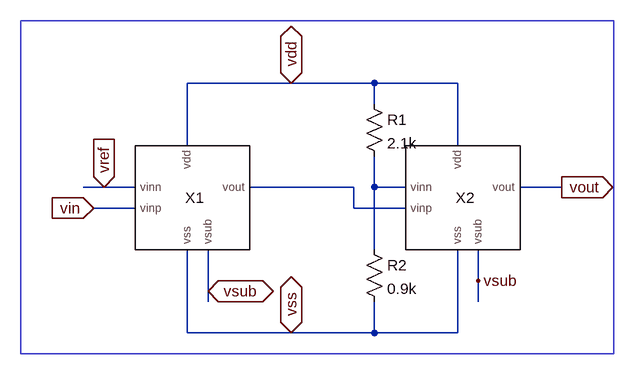
[diagram p0: schematic dsproj_twostagecomparator.asc]
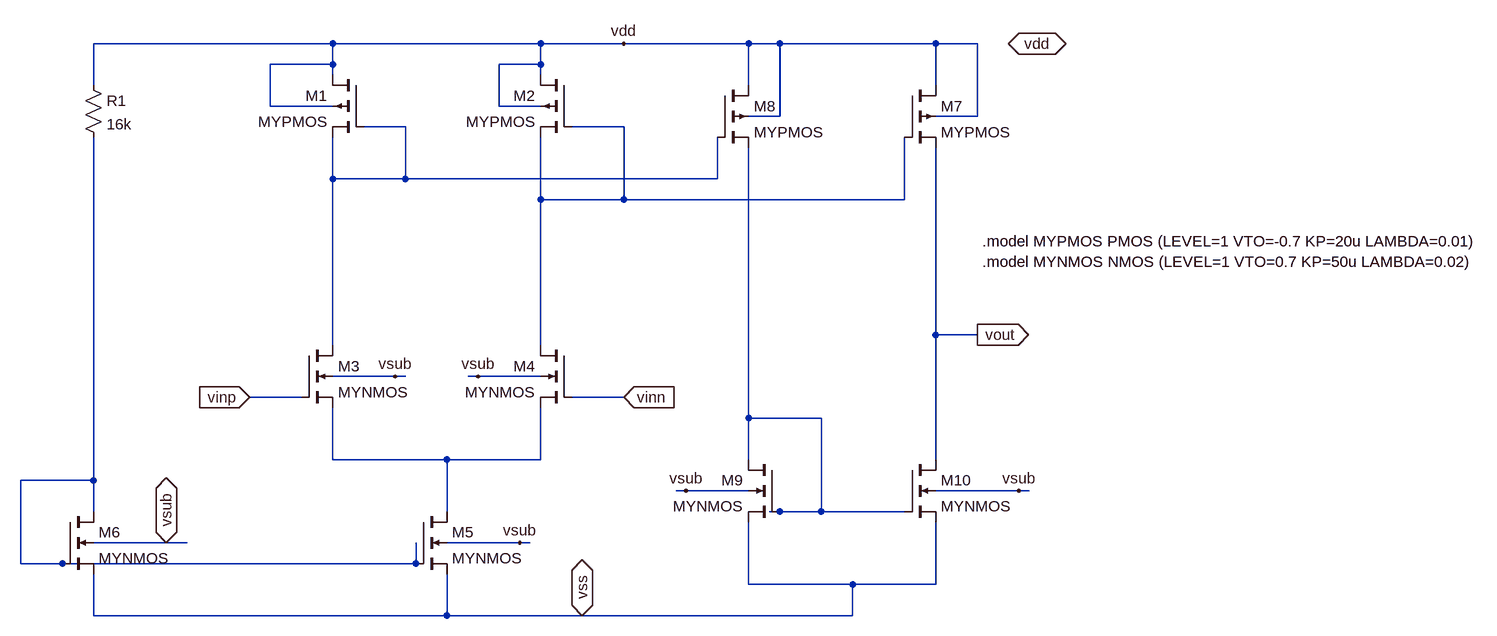
[diagram p1: sub-circuit dsproj_nmos_comparator.asc]
dsproj_twostagecomparator.asc, the LTspice schematic file:
Version 4
SHEET 1 880 680
WIRE 160 -32 0 -32
WIRE 288 -32 160 -32
WIRE 416 -32 288 -32
WIRE 288 0 288 -32
WIRE 0 64 0 -32
WIRE 416 64 416 -32
WIRE -128 128 -160 128
WIRE -80 128 -128 128
WIRE 256 128 96 128
WIRE 288 128 288 80
WIRE 336 128 288 128
WIRE 576 128 512 128
WIRE -80 160 -144 160
WIRE 256 160 256 128
WIRE 336 160 256 160
WIRE 288 224 288 128
WIRE 448 272 448 224
WIRE 32 288 32 224
WIRE 32 304 32 288
WIRE 448 304 448 272
WIRE 0 352 0 224
WIRE 160 352 0 352
WIRE 288 352 288 304
WIRE 288 352 160 352
WIRE 416 352 416 224
WIRE 416 352 288 352
FLAG 32 288 vsub
IOPIN 32 288 BiDir
FLAG 448 272 vsub
FLAG 160 -32 vdd
IOPIN 160 -32 BiDir
FLAG 160 352 vss
IOPIN 160 352 BiDir
FLAG -128 128 vref
IOPIN -128 128 In
FLAG -144 160 vin
IOPIN -144 160 In
FLAG 576 128 vout
IOPIN 576 128 Out
SYMBOL dsproj_nmos_comparator 0 144 R0
SYMATTR InstName X1
SYMBOL dsproj_nmos_comparator 416 144 R0
SYMATTR InstName X2
SYMBOL res 272 -16 R0
SYMATTR InstName R1
SYMATTR Value 2.1k
SYMBOL res 272 208 R0
SYMATTR InstName R2
SYMATTR Value 0.9k
RECTANGLE Normal 656 384 -256 -128

dsproj_nmos_comparator.asc, the sub-circuit schematic file:
Version 4.1
SHEET 1 1360 680
WIRE -432 -416 -800 -416
WIRE -112 -416 -432 -416
WIRE 16 -416 -112 -416
WIRE 208 -416 16 -416
WIRE 256 -416 208 -416
WIRE 496 -416 256 -416
WIRE 560 -416 496 -416
WIRE -432 -384 -432 -416
WIRE -432 -384 -528 -384
WIRE -112 -384 -112 -416
WIRE -112 -384 -176 -384
WIRE -432 -368 -432 -384
WIRE -112 -368 -112 -384
WIRE -800 -352 -800 -416
WIRE 208 -352 208 -416
WIRE 496 -352 496 -416
WIRE -528 -320 -528 -384
WIRE -432 -320 -528 -320
WIRE -176 -320 -176 -384
WIRE -112 -320 -176 -320
WIRE 256 -304 256 -416
WIRE 256 -304 208 -304
WIRE 560 -304 560 -416
WIRE 560 -304 496 -304
WIRE -320 -288 -384 -288
WIRE 16 -288 -64 -288
WIRE -432 -208 -432 -272
WIRE -320 -208 -320 -288
WIRE -320 -208 -432 -208
WIRE 160 -208 160 -272
WIRE 160 -208 -320 -208
WIRE -112 -176 -112 -272
WIRE 16 -176 16 -288
WIRE 16 -176 -112 -176
WIRE 448 -176 448 -272
WIRE 448 -176 16 -176
WIRE 496 32 496 -256
WIRE 560 32 496 32
WIRE -432 48 -432 -208
WIRE -112 48 -112 -176
WIRE -336 96 -432 96
WIRE -320 96 -336 96
WIRE -208 96 -224 96
WIRE -112 96 -208 96
WIRE -480 128 -560 128
WIRE 16 128 -64 128
WIRE 208 160 208 -256
WIRE 320 160 208 160
WIRE -432 224 -432 144
WIRE -256 224 -432 224
WIRE -112 224 -112 144
WIRE -112 224 -256 224
WIRE 208 224 208 160
WIRE 496 224 496 32
WIRE -800 256 -800 -272
WIRE -800 256 -912 256
WIRE 112 272 96 272
WIRE 208 272 112 272
WIRE 624 272 496 272
WIRE 640 272 624 272
WIRE -800 304 -800 256
WIRE -256 304 -256 224
WIRE 256 304 240 304
WIRE 320 304 320 160
WIRE 320 304 256 304
WIRE 448 304 320 304
WIRE -688 352 -800 352
WIRE -656 352 -688 352
WIRE -144 352 -256 352
WIRE -128 352 -144 352
WIRE -912 384 -912 256
WIRE -848 384 -912 384
WIRE -304 384 -304 352
WIRE -304 384 -848 384
WIRE 208 416 208 320
WIRE 368 416 208 416
WIRE 496 416 496 320
WIRE 496 416 368 416
WIRE -800 464 -800 400
WIRE -256 464 -256 400
WIRE -256 464 -800 464
WIRE -48 464 -256 464
WIRE 368 464 368 416
WIRE 368 464 -48 464
FLAG -208 96 vsub
FLAG 560 32 vout
IOPIN 560 32 Out
FLAG 608 -416 vdd
IOPIN 608 -416 BiDir
FLAG -560 128 vinp
IOPIN -560 128 In
FLAG 16 128 vinn
IOPIN 16 128 In
FLAG 112 272 vsub
FLAG 624 272 vsub
FLAG -48 464 vss
IOPIN -48 464 BiDir
FLAG -688 352 vsub
IOPIN -688 352 BiDir
FLAG -144 352 vsub
FLAG 16 -416 vdd
FLAG -336 96 vsub
SYMBOL pmos4 -384 -368 M0
SYMATTR InstName M1
SYMATTR Value MYPMOS
SYMATTR Value2 l=180e-9 w=1.2e-6 m=2
SYMBOL pmos4 -64 -368 M0
SYMATTR InstName M2
SYMATTR Value MYPMOS
SYMATTR Value2 l=180e-9 w=1.2e-6 m=2
SYMBOL nmos4 -64 48 M0
SYMATTR InstName M4
SYMATTR Value MYNMOS
SYMATTR Value2 l=180e-9 w=1.2e-6 m=3
SYMBOL nmos4 -304 304 R0
SYMATTR InstName M5
SYMATTR Value MYNMOS
SYMATTR Value2 l=3e-6 w=10e-6 m=2
SYMBOL res -816 -368 R0
SYMATTR InstName R1
SYMATTR Value 16k
SYMBOL nmos4 -848 304 R0
SYMATTR InstName M6
SYMATTR Value MYNMOS
SYMATTR Value2 l=3e-6 w=10e-6 m=2
SYMBOL nmos4 -480 48 R0
SYMATTR InstName M3
SYMATTR Value MYNMOS
SYMATTR Value2 l=180e-9 w=1.2e-6 m=3
SYMBOL pmos4 448 -352 R0
SYMATTR InstName M7
SYMATTR Value MYPMOS
SYMATTR Value2 l=180e-9 w=1.2e-6 m=2
SYMBOL pmos4 160 -352 R0
SYMATTR InstName M8
SYMATTR Value MYPMOS
SYMATTR Value2 l=180e-9 w=1.2e-6 m=2
SYMBOL nmos4 256 224 M0
SYMATTR InstName M9
SYMATTR Value MYNMOS
SYMATTR Value2 l=180e-9 w=1.2e-6 m=1
SYMBOL nmos4 448 224 R0
SYMATTR InstName M10
SYMATTR Value MYNMOS
SYMATTR Value2 l=180e-9 w=1.2e-6 m=1
TEXT 568 -112 Left 2 !.model MYPMOS PMOS (LEVEL=1 VTO=-0.7 KP=20u LAMBDA=0.01)\n.model MYNMOS NMOS (LEVEL=1 VTO=0.7 KP=50u LAMBDA=0.02)

The netlist it stands for:
* dsproj_twostagecomparator.asc
XX1 vref vin vdd N001 vss vsub dsproj_nmos_comparator
XX2 N002 N001 vdd vout vss vsub dsproj_nmos_comparator
R1 vdd N002 2.1k
R2 N002 vss 0.9k

* block symbol definitions
.subckt dsproj_nmos_comparator vinn vinp vdd vout vss vsub
M1 vdd N001 N001 vdd MYPMOS l=180e-9 w=1.2e-6 m=2
M2 vdd N002 N002 vdd MYPMOS l=180e-9 w=1.2e-6 m=2
M4 N002 vinn N004 vsub MYNMOS l=180e-9 w=1.2e-6 m=3
M5 N004 N005 vss vsub MYNMOS l=3e-6 w=10e-6 m=2
R1 vdd N005 16k
M6 N005 N005 vss vsub MYNMOS l=3e-6 w=10e-6 m=2
M3 N001 vinp N004 vsub MYNMOS l=180e-9 w=1.2e-6 m=3
M7 vdd N002 vout vdd MYPMOS l=180e-9 w=1.2e-6 m=2
M8 vdd N001 N003 vdd MYPMOS l=180e-9 w=1.2e-6 m=2
M9 N003 N003 vss vsub MYNMOS l=180e-9 w=1.2e-6 m=1
M10 vout N003 vss vsub MYNMOS l=180e-9 w=1.2e-6 m=1
.model MYPMOS PMOS (LEVEL=1 VTO=-0.7 KP=20u LAMBDA=0.01)
.model MYNMOS NMOS (LEVEL=1 VTO=0.7 KP=50u LAMBDA=0.02)
.ends dsproj_nmos_comparator

.model NMOS NMOS
.model PMOS PMOS
.lib standard.mos
.backanno
.end